# Altium project TTAmp.PrjPCB
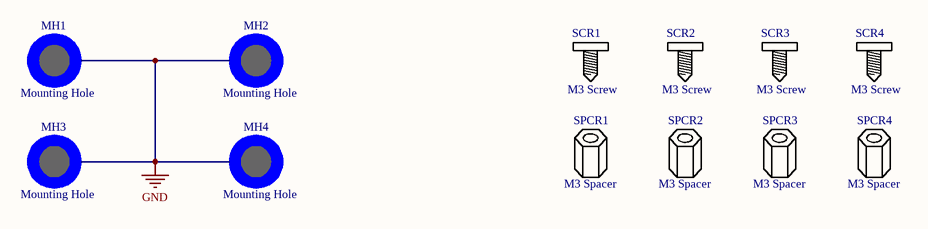
[diagram p0: TTAmp_Mechanical.SchDoc]
2 sheets, 12 parts. Net scope: global (net labels, ports and power ports of the same name join across sheets).
Sheets:
  TTAmp_main.SchDoc
  TTAmp_Mechanical.SchDoc

## Sheet TTAmp_main.SchDoc
size A4; ApprovedBy: Krzysztof Belewicz; CheckedBy: Krzysztof Belewicz; Author: Krzysztof Belewicz; CompanyName: Koło Naukowe Systemów Scalonych; DrawnBy: Krzysztof Belewicz; Organization: KNSS; Address1: Koło Naukowe; Address2: Systemów Scalonych; Address3: 00-665 Warszawa; Address4: Nowowiejska 15/19; Revision: 0.1; SheetNumber: 1; SheetTotal: 2

### Notes on the sheet
- Project:
- Variant:
- File:
- Sheet:
- Revision:
- Total Sheet:
- Author:
- Modified:

## Sheet TTAmp_Mechanical.SchDoc
size A4; ApprovedBy: Krzysztof Belewicz; CheckedBy: Krzysztof Belewicz; Author: Krzysztof Belewicz; CompanyName: Koło Naukowe Systemów Scalonych; DrawnBy: Krzysztof Belewicz; Organization: KNSS; Address1: Koło Naukowe; Address2: Systemów Scalonych; Address3: 00-665 Warszawa; Address4: Nowowiejska 15/19; Revision: 0.1; SheetNumber: 2; SheetTotal: 2

### Parts
MH1  Mounting Hole  [MH-M3_Copper]  (no BOM)
MH2  Mounting Hole  [MH-M3_Copper]  (no BOM)
MH3  Mounting Hole  [MH-M3_Copper]  (no BOM)
MH4  Mounting Hole  [MH-M3_Copper]  (no BOM)
SCR1  M3 Screw  (mechanical)
SCR2  M3 Screw  (mechanical)
SCR3  M3 Screw  (mechanical)
SCR4  M3 Screw  (mechanical)
SPCR1  M3 Spacer  (mechanical)
SPCR2  M3 Spacer  (mechanical)
SPCR3  M3 Spacer  (mechanical)
SPCR4  M3 Spacer  (mechanical)

### Nets
GND: MH1.MH MH2.MH MH3.MH MH4.MH

### Notes on the sheet
- Project:
- Variant:
- File:
- Sheet:
- Revision:
- Total Sheet:
- Author:
- Modified:

### Library data of the parts
MH1-MH4 = MH: M3 mounting hole
SCR1-SCR4 = SCREW: Supplier 1: *; Manufacturer 1: *; Supplier Part Number 1: *; Manufacturer Part Number 1: *
SPCR1-SPCR4 = SPCR: Supplier 1: *; Manufacturer 1: *; Supplier Part Number 1: *; Manufacturer Part Number 1: *